# EAGLE design untitled (EAGLE 9.6.2)
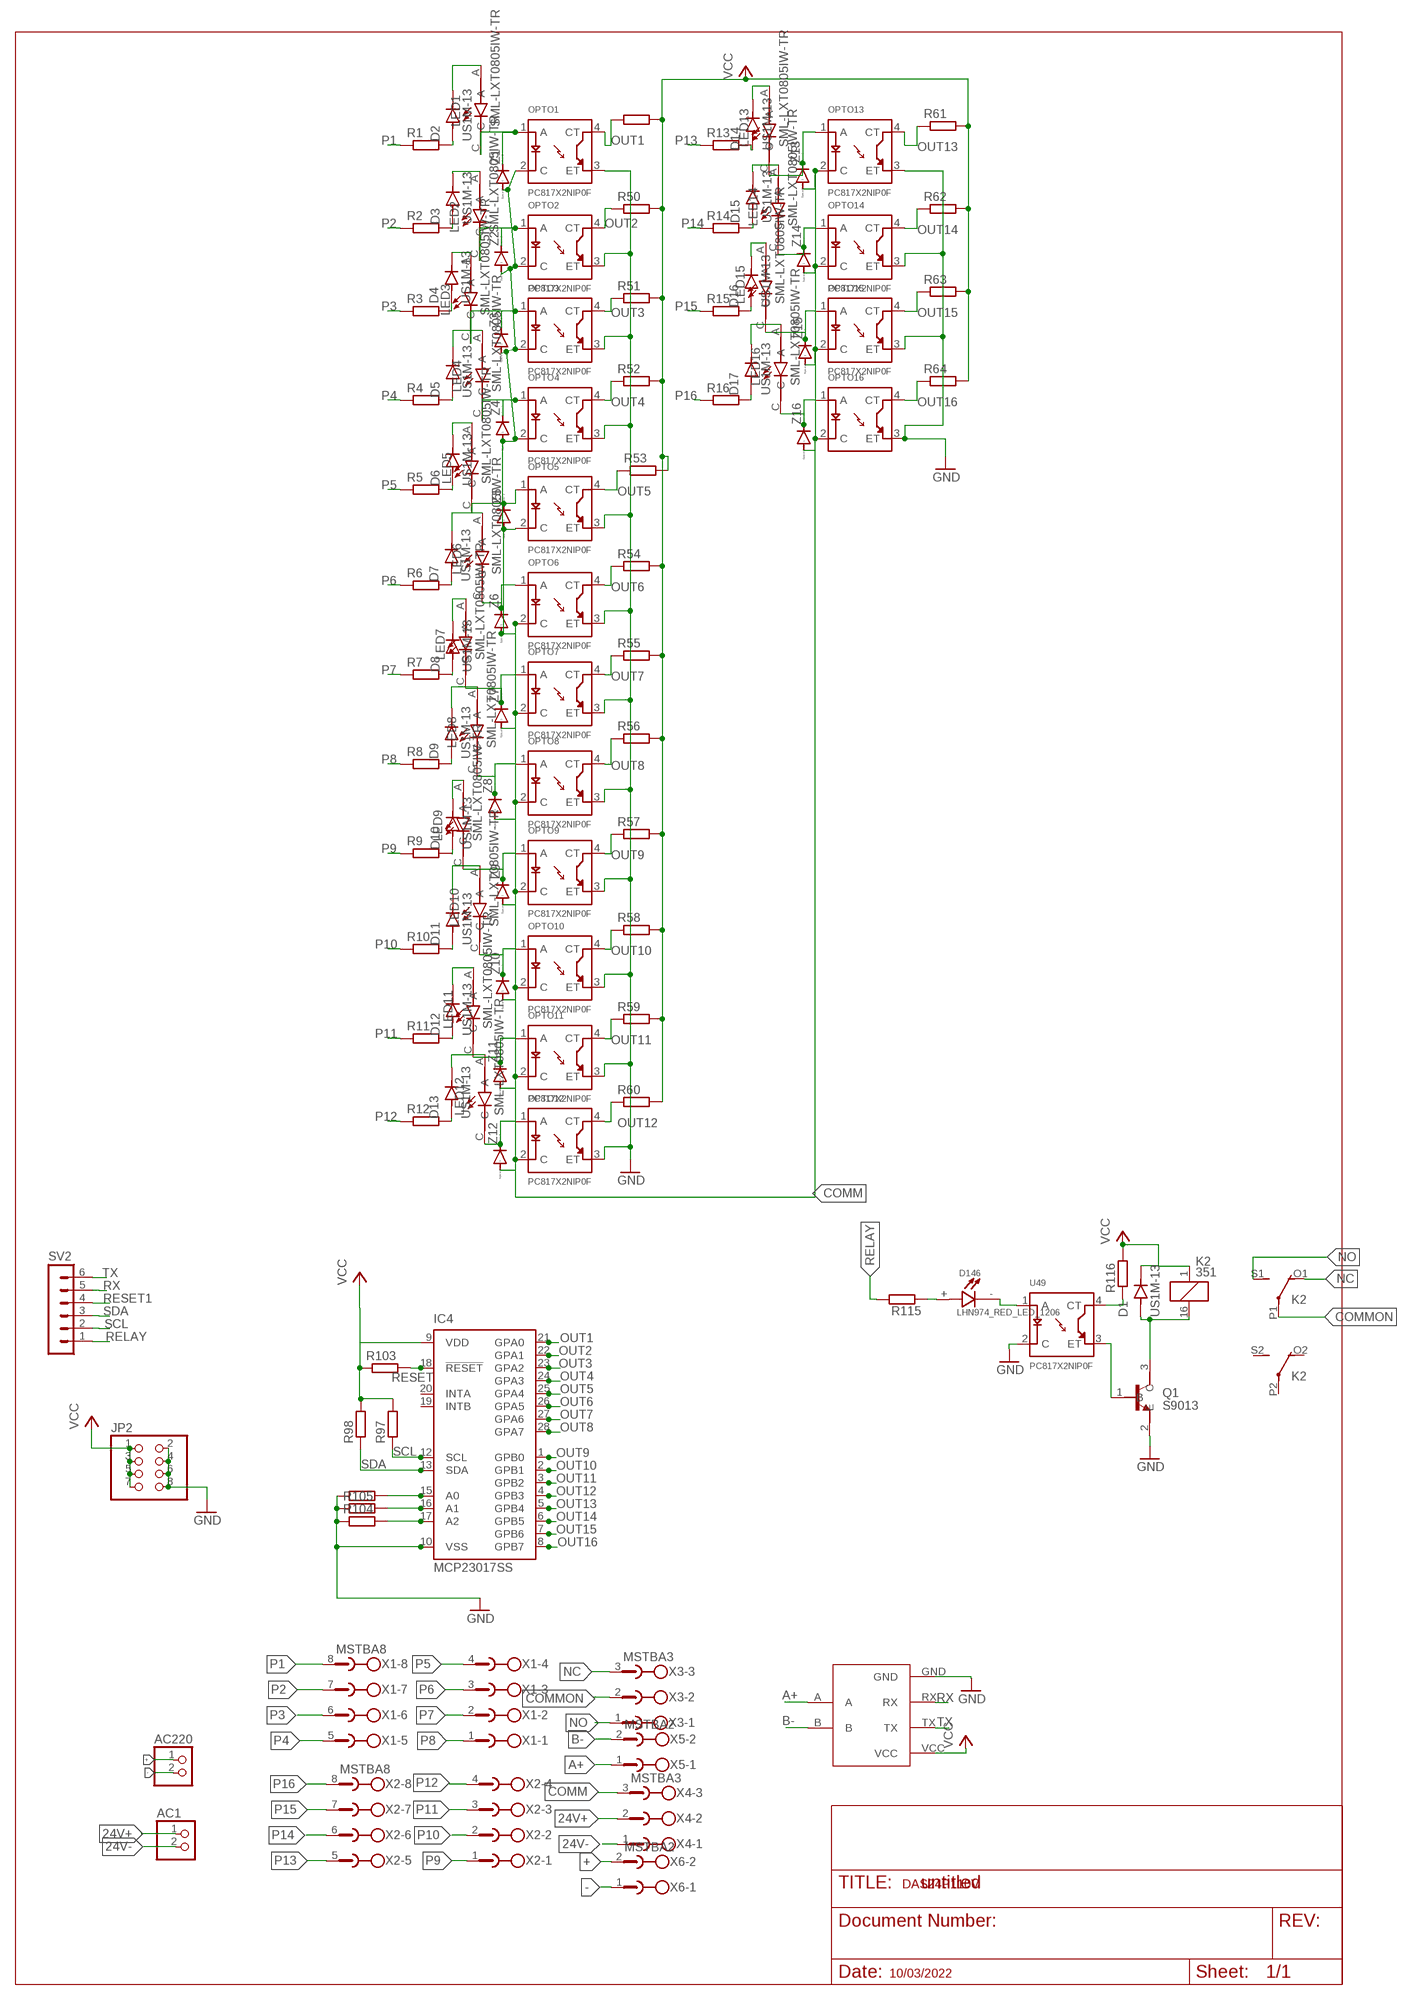
[diagram p0: schematic, sheet 1]

## Parts
AC1  PINHD-1X2  [1X02]
AC220  PINHD-1X2  [1X02]
D1  US1M-13  [DIOM5226X240N]
D2  US1M-13  [DIOM5226X240N]
D3  US1M-13  [DIOM5226X240N]
D4  US1M-13  [DIOM5226X240N]
D5  US1M-13  [DIOM5226X240N]
D6  US1M-13  [DIOM5226X240N]
D7  US1M-13  [DIOM5226X240N]
D8  US1M-13  [DIOM5226X240N]
D9  US1M-13  [DIOM5226X240N]
D10  US1M-13  [DIOM5226X240N]
D11  US1M-13  [DIOM5226X240N]
D12  US1M-13  [DIOM5226X240N]
D13  US1M-13  [DIOM5226X240N]
D14  US1M-13  [DIOM5226X240N]
D15  US1M-13  [DIOM5226X240N]
D16  US1M-13  [DIOM5226X240N]
D17  US1M-13  [DIOM5226X240N]
D146  LHN974_RED_LED_1206  [LEDC3216X120N]
IC4  MCP23017SS  [SSOP28DB]
JP2  PINHD-2X4  [2X04]
K2  351  [351]
LED1  SML-LXT0805IW-TR  [LEDC2012X120N]
LED2  SML-LXT0805IW-TR  [LEDC2012X120N]
LED3  SML-LXT0805IW-TR  [LEDC2012X120N]
LED4  SML-LXT0805IW-TR  [LEDC2012X120N]
LED5  SML-LXT0805IW-TR  [LEDC2012X120N]
LED6  SML-LXT0805IW-TR  [LEDC2012X120N]
LED7  SML-LXT0805IW-TR  [LEDC2012X120N]
LED8  SML-LXT0805IW-TR  [LEDC2012X120N]
LED9  SML-LXT0805IW-TR  [LEDC2012X120N]
LED10  SML-LXT0805IW-TR  [LEDC2012X120N]
LED11  SML-LXT0805IW-TR  [LEDC2012X120N]
LED12  SML-LXT0805IW-TR  [LEDC2012X120N]
LED13  SML-LXT0805IW-TR  [LEDC2012X120N]
LED14  SML-LXT0805IW-TR  [LEDC2012X120N]
LED15  SML-LXT0805IW-TR  [LEDC2012X120N]
LED16  SML-LXT0805IW-TR  [LEDC2012X120N]
OPTO1  PC817X2NIP0F  [SOT254P975X400-4N]
OPTO2  PC817X2NIP0F  [SOT254P975X400-4N]
OPTO3  PC817X2NIP0F  [SOT254P975X400-4N]
OPTO4  PC817X2NIP0F  [SOT254P975X400-4N]
OPTO5  PC817X2NIP0F  [SOT254P975X400-4N]
OPTO6  PC817X2NIP0F  [SOT254P975X400-4N]
OPTO7  PC817X2NIP0F  [SOT254P975X400-4N]
OPTO8  PC817X2NIP0F  [SOT254P975X400-4N]
OPTO9  PC817X2NIP0F  [SOT254P975X400-4N]
OPTO10  PC817X2NIP0F  [SOT254P975X400-4N]
OPTO11  PC817X2NIP0F  [SOT254P975X400-4N]
OPTO12  PC817X2NIP0F  [SOT254P975X400-4N]
OPTO13  PC817X2NIP0F  [SOT254P975X400-4N]
OPTO14  PC817X2NIP0F  [SOT254P975X400-4N]
OPTO15  PC817X2NIP0F  [SOT254P975X400-4N]
OPTO16  PC817X2NIP0F  [SOT254P975X400-4N]
Q1  S9013  [SOT95P240X120-3N]
R1  R-EU_0414/15  [0414/15]
R2  R-EU_0414/15  [0414/15]
R3  R-EU_0414/15  [0414/15]
R4  R-EU_0414/15  [0414/15]
R5  R-EU_0414/15  [0414/15]
R6  R-EU_0414/15  [0414/15]
R7  R-EU_0414/15  [0414/15]
R8  R-EU_0414/15  [0414/15]
R9  R-EU_0414/15  [0414/15]
R10  R-EU_0414/15  [0414/15]
R11  R-EU_0414/15  [0414/15]
R12  R-EU_0414/15  [0414/15]
R13  R-EU_0414/15  [0414/15]
R14  R-EU_0414/15  [0414/15]
R15  R-EU_0414/15  [0414/15]
R16  R-EU_0414/15  [0414/15]
R49  R-EU_R0805  [R0805]
R50  R-EU_R0805  [R0805]
R51  R-EU_R0805  [R0805]
R52  R-EU_R0805  [R0805]
R53  R-EU_R0805  [R0805]
R54  R-EU_R0805  [R0805]
R55  R-EU_R0805  [R0805]
R56  R-EU_R0805  [R0805]
R57  R-EU_R0805  [R0805]
R58  R-EU_R0805  [R0805]
R59  R-EU_R0805  [R0805]
R60  R-EU_R0805  [R0805]
R61  R-EU_R0805  [R0805]
R62  R-EU_R0805  [R0805]
R63  R-EU_R0805  [R0805]
R64  R-EU_R0805  [R0805]
R97  R-EU_R0805  [R0805]
R98  R-EU_R0805  [R0805]
R103  R-EU_R0805  [R0805]
R104  R-EU_R0805  [R0805]
R105  R-EU_R0805  [R0805]
R106  R-EU_R0805  [R0805]
R115  R-EU_R0805  [R0805]
R116  R-EU_R0805  [R0805]
SV2  MA06-1  [MA06-1]
TTL-RS1  TTL-RS485  [TTL-RS485]
U49  PC817X2NIP0F  [SOT254P975X400-4N]
X1  MSTBA8  [MSTBA8]
X2  MSTBA8  [MSTBA8]
X3  MSTBA3  [MSTBA3]
X4  MSTBA3  [MSTBA3]
X5  MSTBA2  [MSTBA2]
X6  MSTBA2  [MSTBA2]
Z1  DIODE-SOD123  [SOD123]
Z2  DIODE-SOD123  [SOD123]
Z3  DIODE-SOD123  [SOD123]
Z4  DIODE-SOD123  [SOD123]
Z5  DIODE-SOD123  [SOD123]
Z6  DIODE-SOD123  [SOD123]
Z7  DIODE-SOD123  [SOD123]
Z8  DIODE-SOD123  [SOD123]
Z9  DIODE-SOD123  [SOD123]
Z10  DIODE-SOD123  [SOD123]
Z11  DIODE-SOD123  [SOD123]
Z12  DIODE-SOD123  [SOD123]
Z13  DIODE-SOD123  [SOD123]
Z14  DIODE-SOD123  [SOD123]
Z15  DIODE-SOD123  [SOD123]
Z16  DIODE-SOD123  [SOD123]

## Nets
24V+: AC1.1 X4.2
24V-: AC1.2 X4.1
+: AC220.1 X6.2
-: AC220.2 X6.1
A+: TTL-RS1.A X5.1
B-: TTL-RS1.B X5.2
COMM: OPTO1.2(C) OPTO2.2(C) OPTO3.2(C) OPTO4.2(C) OPTO5.2(C) OPTO6.2(C) OPTO7.2(C) OPTO8.2(C) OPTO9.2(C) OPTO10.2(C) OPTO11.2(C) OPTO12.2(C) OPTO13.2(C) OPTO14.2(C) OPTO15.2(C) OPTO16.2(C) X4.3 Z1.A Z2.A Z3.A Z4.A Z5.A Z6.A Z7.A Z8.A Z9.A Z10.A Z11.A Z12.A Z13.A Z14.A Z15.A Z16.A
COMMON: K2.P1(2:P) X3.2
GND: IC4.10(VSS) JP2.2 JP2.4 JP2.6 JP2.8 OPTO1.3(ET) OPTO2.3(ET) OPTO3.3(ET) OPTO4.3(ET) OPTO5.3(ET) OPTO6.3(ET) OPTO7.3(ET) OPTO8.3(ET) OPTO9.3(ET) OPTO10.3(ET) OPTO11.3(ET) OPTO12.3(ET) OPTO13.3(ET) OPTO14.3(ET) OPTO15.3(ET) OPTO16.3(ET) Q1.2(E) R104.1 R105.1 R106.1 TTL-RS1.GND U49.2(C)
N$1: D2.A R1.2
N$2: LED10.C OPTO10.1(A) Z10.C
N$3: D3.A R2.2
N$5: D4.A R3.2
N$6: LED1.C OPTO1.1(A) Z1.C
N$7: D5.A R4.2
N$8: D2.C(K) LED1.A
N$9: D6.A R5.2
N$10: D3.C(K) LED2.A
N$11: D7.A R6.2
N$12: LED2.C OPTO2.1(A) Z2.C
N$13: D8.A R7.2
N$14: D4.C(K) LED3.A
N$15: D9.A R8.2
N$16: LED3.C OPTO3.1(A) Z3.C
N$17: D15.A R14.2
N$18: D5.C(K) LED4.A
N$19: LED4.C OPTO4.1(A) Z4.C
N$20: D10.A R9.2
N$21: D6.C(K) LED5.A
N$22: LED5.C OPTO5.1(A) Z5.C
N$23: D7.C(K) LED6.A
N$24: D11.A R10.2
N$25: D8.C(K) LED7.A
N$26: LED6.C OPTO6.1(A) Z6.C
N$28: D12.A R11.2
N$36: D13.A R12.2
N$40: D14.A R13.2
N$44: D16.A R15.2
N$48: D17.A R16.2
N$49: D9.C(K) LED8.A
N$50: D10.C(K) LED9.A
N$51: D11.C(K) LED10.A
N$53: D12.C(K) LED11.A
N$54: D13.C(K) LED12.A
N$55: D14.C(K) LED13.A
N$57: D15.C(K) LED14.A
N$58: D16.C(K) LED15.A
N$59: D17.C(K) LED16.A
N$70: LED7.C OPTO7.1(A) Z7.C
N$72: LED8.C OPTO8.1(A) Z8.C
N$73: LED9.C OPTO9.1(A) Z9.C
N$74: LED11.C OPTO11.1(A) Z11.C
N$75: LED12.C OPTO12.1(A) Z12.C
N$77: LED13.C OPTO13.1(A) Z13.C
N$78: LED14.C OPTO14.1(A) Z14.C
N$79: LED15.C OPTO15.1(A) Z15.C
N$81: LED16.C OPTO16.1(A) Z16.C
N$97: D146.- U49.1(A)
N$98: D146.+ R115.1
N$99: R116.1 U49.4(CT)
N$101: D1.A K2.16 Q1.3(C)
N$102: Q1.1(B) U49.3(ET)
N$109: IC4.15(A0) R106.2
N$110: IC4.16(A1) R105.2
N$111: IC4.17(A2) R104.2
NC: K2.O1(2:O) X3.3
NO: K2.S1(2:S) X3.1
OUT1: IC4.21(GPA0) OPTO1.4(CT) R49.1
OUT2: IC4.22(GPA1) OPTO2.4(CT) R50.1
OUT3: IC4.23(GPA2) OPTO3.4(CT) R51.1
OUT4: IC4.24(GPA3) OPTO4.4(CT) R52.1
OUT5: IC4.25(GPA4) OPTO5.4(CT) R53.1
OUT6: IC4.26(GPA5) OPTO6.4(CT) R54.1
OUT7: IC4.27(GPA6) OPTO7.4(CT) R55.1
OUT8: IC4.28(GPA7) OPTO8.4(CT) R56.1
OUT9: IC4.1(GPB0) OPTO9.4(CT) R57.1
OUT10: IC4.2(GPB1) OPTO10.4(CT) R58.1
OUT11: IC4.3(GPB2) OPTO11.4(CT) R59.1
OUT12: IC4.4(GPB3) OPTO12.4(CT) R60.1
OUT13: IC4.5(GPB4) OPTO13.4(CT) R61.1
OUT14: IC4.6(GPB5) OPTO14.4(CT) R62.1
OUT15: IC4.7(GPB6) OPTO15.4(CT) R63.1
OUT16: IC4.8(GPB7) OPTO16.4(CT) R64.1
P1: R1.1 X1.8
P2: R2.1 X1.7
P3: R3.1 X1.6
P4: R4.1 X1.5
P5: R5.1 X1.4
P6: R6.1 X1.3
P7: R7.1 X1.2
P8: R8.1 X1.1
P9: R9.1 X2.1
P10: R10.1 X2.2
P11: R11.1 X2.3
P12: R12.1 X2.4
P13: R13.1 X2.5
P14: R14.1 X2.6
P15: R15.1 X2.7
P16: R16.1 X2.8
RELAY: R115.2 SV2.1
RESET: IC4.18(!RESET) R103.2
RESET1: SV2.4
RX: SV2.5 TTL-RS1.RX
SCL: IC4.12(SCL) R97.1 SV2.2
SDA: IC4.13(SDA) R98.1 SV2.3
TX: SV2.6 TTL-RS1.TX
VCC: D1.C(K) IC4.9(VDD) JP2.1 JP2.3 JP2.5 JP2.7 K2.1 R49.2 R50.2 R51.2 R52.2 R53.2 R54.2 R55.2 R56.2 R57.2 R58.2 R59.2 R60.2 R61.2 R62.2 R63.2 R64.2 R97.2 R98.2 R103.1 R116.2 TTL-RS1.VCC
Unconnected: IC4.19(INTB) IC4.20(INTA) K2.O2(3:O) K2.P2(3:P) K2.S2(3:S)

## Notes on the sheet
- DAS24P110V
- 10/03/2022

## Library data of the parts
AC1 AC220 = pinhead:PINHD-1X2: PIN HEADER
D1-D17 = US1M-13:US1M-13: Diode, Fast Recovery, 1a, 1kv, Do-214ac-2, Full Reel Check availability <https://pricing.snapeda.com/parts/US1M-13/Diodes%20Incorporated/view-part?ref=eda>; AVAILABILITY: In Stock; DESCRIPTION: Diode Standard 1000 V 1A Surface Mount SMA; MF: Diodes Incorporated; MP: US1M-13; PACKAGE: DO-214AC-214 Diodes Incorporated; PRICE: None; PURCHASE-URL: https://pricing.snapeda.com/search/part/US1M-13/?ref=eda
D146 = LHN974_RED_LED_1206:LHN974_RED_LED_1206: LED Chip 1206 Check availability <https://pricing.snapeda.com/parts/LHN974%20RED%20LED%201206/Osram/view-part?ref=eda>; AVAILABILITY: Not in stock; DESCRIPTION: 2.6 V Red LED SMD; MF: Osram; MP: LHN974 RED LED 1206; PACKAGE: None; PRICE: None
IC4 = adafruit_edited:MCP23017: http://ww1.microchip.com/downloads/en/DeviceDoc/21952a.pdf Source: http://ww1.microchip.com/downloads/en/DeviceDoc/21952a.pdf
JP2 = pinhead:PINHD-2X4: PIN HEADER
K2 = relay:351: RELAY 2 x switch, Omron; OC_FARNELL: unknown; OC_NEWARK: unknown
LED1-LED16 = SML-LXT0805IW-TR:SML-LXT0805IW-TR: LED; Luminous Intensity:11µcd; Viewing Angle:140°; Forward Current:30mA; Forward Voltage:2V; Color:Red; LED Color:Red; Leaded Process Compatible:Yes; Lens Color:White; Mounting Type:Surface Mount ;RoHS Compliant: Yes Check availability <https://pricing.snapeda.com/parts/SML-LXT0805IW-TR/Lumex%20Opto/Components/view-part?ref=eda>; AVAILABILITY: In Stock; DESCRIPTION: Red - LED Indication - Discrete 2V 0805 (2012 Metric); MF: Lumex Opto/Components; MP: SML-LXT0805IW-TR; PACKAGE: 0805 Lumex; PRICE: None; PURCHASE-URL: https://pricing.snapeda.com/search/part/SML-LXT0805IW-TR/?ref=eda
OPTO1-OPTO16 U49 = PC817X2NIP0F:PC817X2NIP0F: PC817 Series 1 Channel 80 V 5000 Vrms General Purpose Photocoupler - DIP-4 Check availability <https://pricing.snapeda.com/parts/PC817X2NIP0F/Sharp%20Microelectronics/view-part?ref=eda>; AVAILABILITY: Not in stock; DESCRIPTION: Optoisolator Transistor Output 5000Vrms 1 Channel 4-SMD; MF: Sharp Microelectronics; MP: PC817X2NIP0F; PACKAGE: SMD-4 Sharp Microelectronics; PRICE: None
Q1 = S9013:S9013: SMD Transistors NPN 25V-500mA Check availability <https://pricing.snapeda.com/parts/S9013/JCET/view-part?ref=eda>; AVAILABILITY: Not in stock; DESCRIPTION: Bipolar (BJT) Transistor NPN 20V 500mA 625mW Through Hole TO-92-3; MF: JCET; MP: S9013; PACKAGE: SOT-23-3 JCET; PRICE: None
R1-R16 R49-R64 R97 R98 R103-R106 R115 R116 = rcl:R-EU_: RESISTOR, European symbol; SPICEPREFIX: R
SV2 = con-lstb:MA06-1: PIN HEADER; OC_FARNELL: unknown; OC_NEWARK: unknown
TTL-RS1 = TTL-RS485:TTL-RS485
X1 X2 = con-phoenix-508:MSTBA8: PHOENIX; MF: FARNELL; MPN: 1757307; OC_FARNELL: 3705225; OC_NEWARK: 71C4166
X3 X4 = con-phoenix-508:MSTBA3: PHOENIX; MF: FARNELL; MPN: 1757255; OC_FARNELL: 3705183; OC_NEWARK: 71C4162
X5 X6 = con-phoenix-508:MSTBA2: PHOENIX; MF: FARNELL; MPN: 1757242; OC_FARNELL: 3705171; OC_NEWARK: 71C4161
Z1-Z16 = diode:DIODE-: DIODE

## Net classes
0 default: drill 0.3 mm, clearance 0.2 mm

## Board
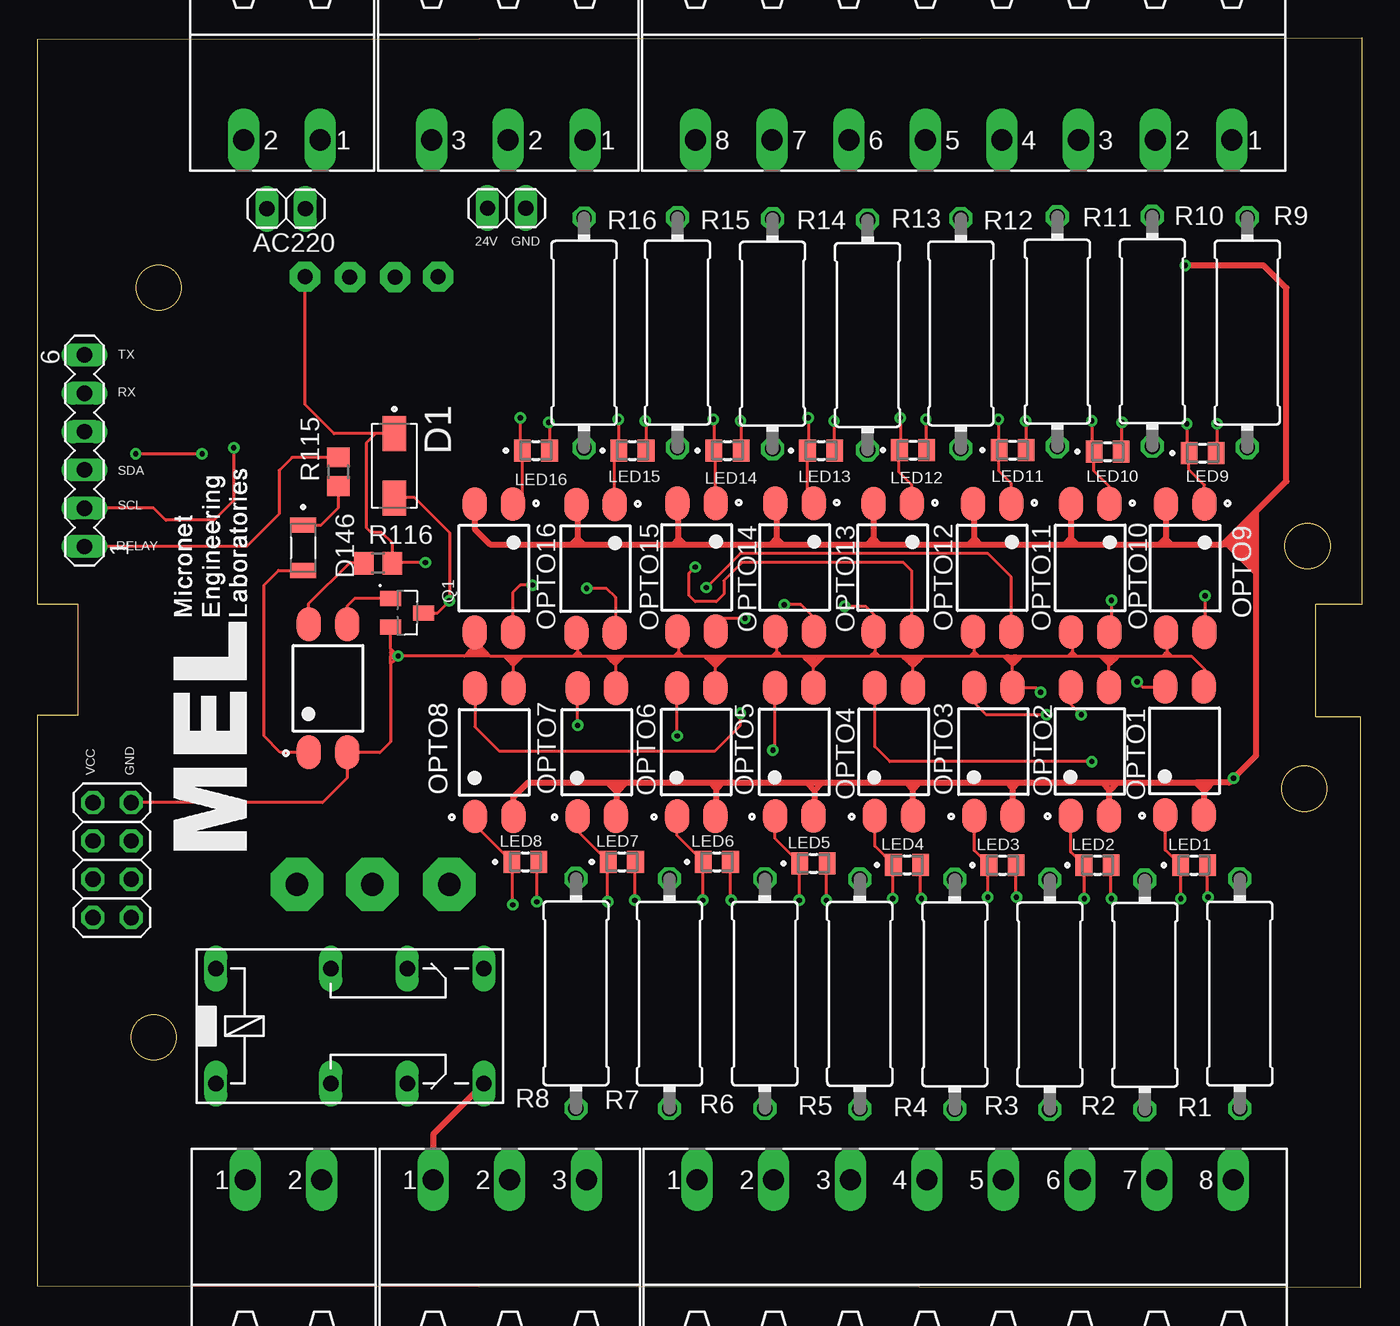
[diagram p1: board, top side]
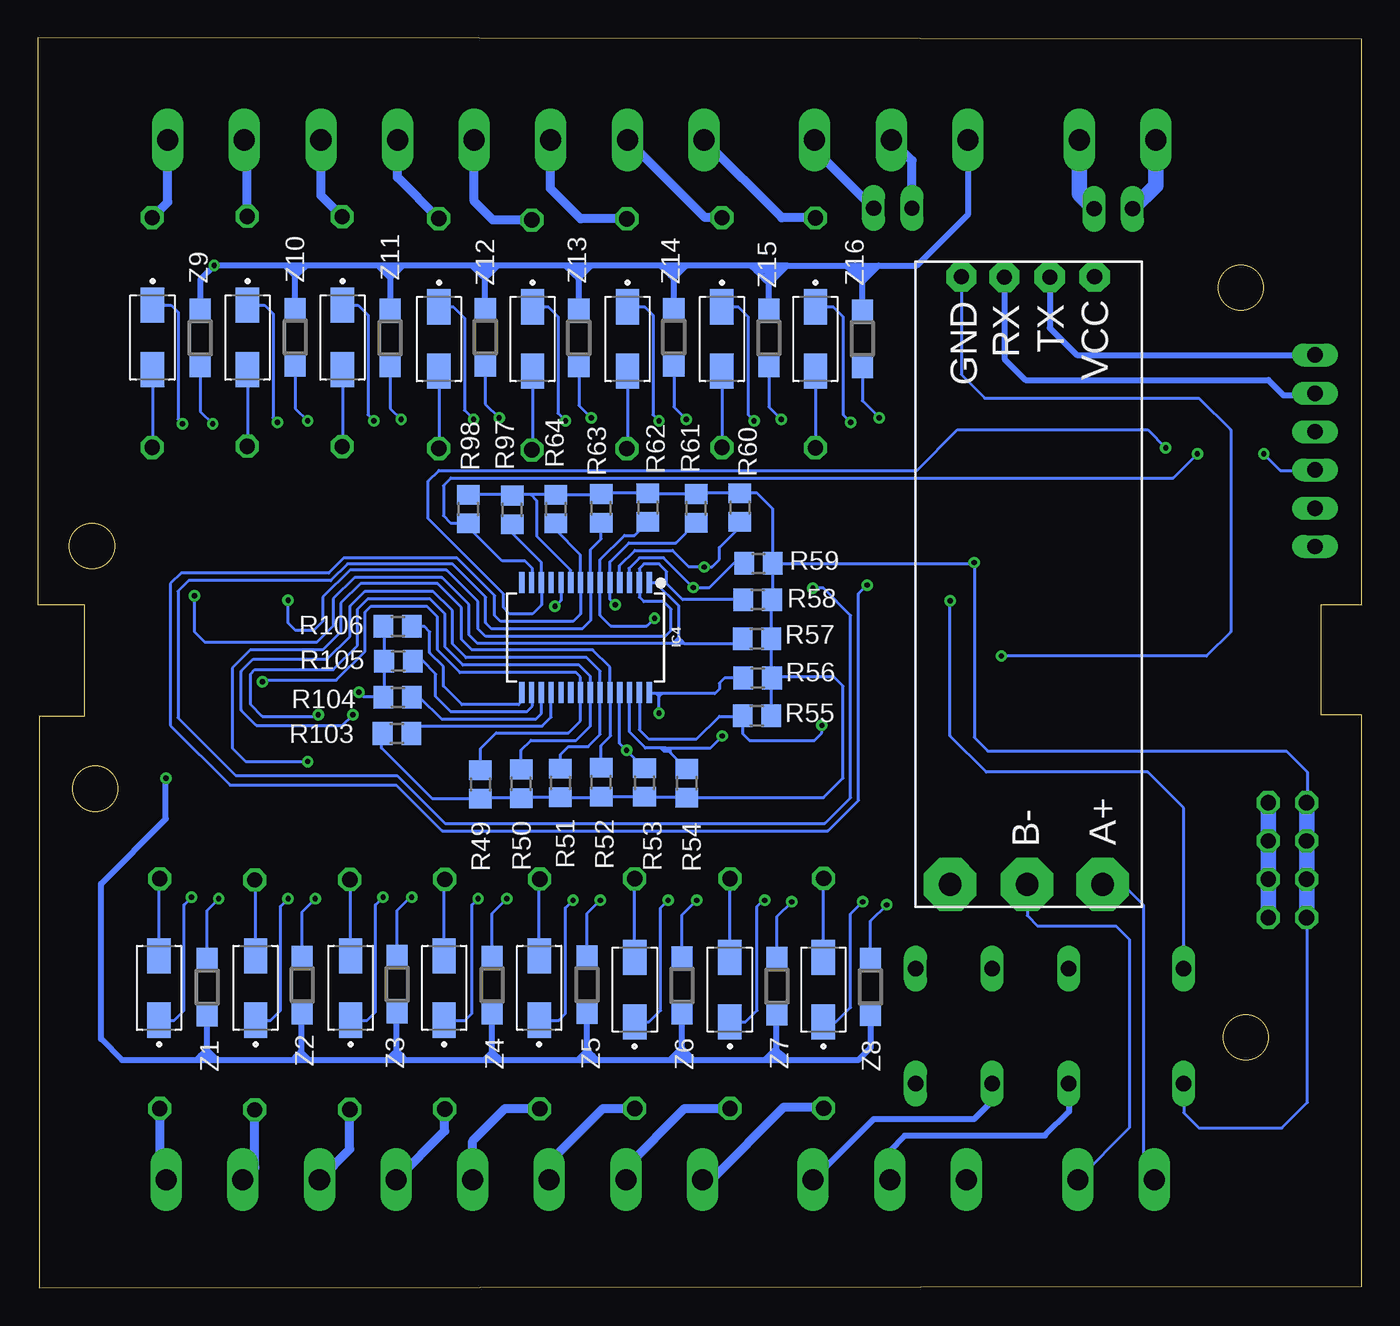
[diagram p2: board, bottom side, seen from below]

Size 87.8 x 82.9 mm. Coordinates in mm from the lower left corner, seen from the top.
Outline: 0,0.1 0,38 2.7,38 2.7,45.3 0,45.3 0,82.8 87.8,82.9 87.8,45.3 84.7,45.3 84.7,37.9 87.7,37.9 87.7,0 0,0.1
Outline: circle at 8.01,66.33 radius 1.5
Outline: circle at 84.2,49.2 radius 1.5
Outline: circle at 84,33.1 radius 1.5
Outline: circle at 7.7,16.6 radius 1.5
Copper layers (1*16): Top 0.035mm / dielectric 1.5mm / Bottom 0.035mm
Design rules "default": minimum track width 6mil, minimum drill 0.35mm, track to track 6mil, track to pad 6mil, pad to pad 6mil, via to via 6mil, smd to smd 6mil, copper to edge 40mil, drill to drill 6mil, minimum pad ring 10mil, minimum via ring 8mil, stop-mask expansion 4mil, vias tented up to drill 0mil, thermal gap 10mil

### Footprints (pad centres in the part's own frame; a part is rotated, then mirrored left to right if it is on the bottom)
1X02 = drill 1.016 long: 1 -1.27,0; 2 1.27,0
DIOM5226X240N = smd 2.33 x 1.55: A 2.135,0; C -2.135,0
LEDC3216X120N = smd 1.01 x 1.73: + -1.51,0; - 1.51,0
SSOP28DB = smd 0.348 x 1.397: 1 -4.225,-3.656; 2 -3.575,-3.656; 3 -2.925,-3.656; 4 -2.275,-3.656; 5 -1.625,-3.656; 6 -0.975,-3.656; 7 -0.325,-3.656; 8 0.325,-3.656; 9 0.975,-3.656; 10 1.625,-3.656; 11 2.275,-3.656; 12 2.925,-3.656; 13 3.575,-3.656; 14 4.225,-3.656; 15 4.225,3.656; 16 3.575,3.656; 17 2.925,3.656; 18 2.275,3.656; 19 1.625,3.656; 20 0.975,3.656; 21 0.325,3.656; 22 -0.325,3.656; 23 -0.975,3.656; 24 -1.625,3.656; 25 -2.275,3.656; 26 -2.925,3.656; 27 -3.575,3.656; 28 -4.225,3.656
2X04 = drill 1.016 octagon: 1 -3.81,-1.27; 2 -3.81,1.27; 3 -1.27,-1.27; 4 -1.27,1.27; 5 1.27,-1.27; 6 1.27,1.27; 7 3.81,-1.27; 8 3.81,1.27
351 = drill 1.016 long: 1 -3.81,-3.81; 16 -3.81,3.81; O1 8.89,-3.81; O2 8.89,3.81; P1 3.81,-3.81; P2 3.81,3.81; S1 13.97,-3.81; S2 13.97,3.81
LEDC2012X120N = smd 1.1 x 1.45: A 0.9,0; C -0.9,0
SOT254P975X400-4N = smd 2.25 x 1.6: 1 -4.25,1.27; 2 -4.25,-1.27; 3 4.25,-1.27; 4 4.25,1.27
SOT95P240X120-3N = smd 1 x 1.4: 1 -0.95,-1.1; 2 0.95,-1.1; 3 0,1.1
0414/15 = drill 1.016 octagon: 1 -7.62,0; 2 7.62,0
R0805 = smd 1.3 x 1.5: 1 -0.95,0; 2 0.95,0
MA06-1 = drill 1.016 long: 1 -6.35,0; 2 -3.81,0; 3 -1.27,0; 4 1.27,0; 5 3.81,0; 6 6.35,0
TTL-RS485 = drill 1.5 pad 3.5 octagon: A -19.7,-6; B -19.7,-1; P$7 -19.7,4.1 | drill 1 pad 2 octagon: GND 20.6,3.37; RX 20.581,0.505; TX 20.583,-2.493; VCC 20.6,-5.47
MSTBA8 = drill 1.397 long: 1 -17.78,5.08; 2 -12.7,5.08; 3 -7.62,5.08; 4 -2.54,5.08; 5 2.54,5.08; 6 7.62,5.08; 7 12.7,5.08; 8 17.78,5.08
MSTBA3 = drill 1.397 long: 1 -5.08,5.08; 2 0,5.08; 3 5.08,5.08
MSTBA2 = drill 1.397 long: 1 -2.54,5.08; 2 2.54,5.08
SOD123 = smd 1.4 x 1.4: A 1.9,0; C -1.9,0

### Placement (x,y rotation side)
AC1  31.1,71.6 0 top
AC220  16.47,71.56 0 top
D1  23.65,54.51 270 top
D2  79.75,19.89 90 bottom
D3  73.35,19.89 90 bottom
D4  67.05,19.89 90 bottom
D5  60.85,19.89 90 bottom
D6  54.55,19.89 90 bottom
D7  48.21,19.78 90 bottom
D8  41.91,19.78 90 bottom
D9  35.71,19.78 90 bottom
D10  80.19,63.02 270 bottom
D11  73.89,63.02 270 bottom
D12  67.59,63.02 270 bottom
D13  61.19,62.92 270 bottom
D14  54.99,62.92 270 bottom
D15  48.69,62.92 270 bottom
D16  42.43,62.92 270 bottom
D17  36.23,62.92 270 bottom
D146  17.6,49.08 270 top
IC4  51.48,43.13 180 bottom
JP2  4.93,28.37 270 top
K2  15.62,17.36 0 top
LED1  76.67,28.03 0 top
LED2  70.27,28.03 0 top
LED3  63.97,28.03 0 top
LED4  57.64,28.05 0 top
LED5  51.44,28.15 0 top
LED6  45.04,28.25 0 top
LED7  38.74,28.25 0 top
LED8  32.34,28.25 0 top
LED9  77.24,55.35 0 top
LED10  70.94,55.45 0 top
LED11  64.64,55.55 0 top
LED12  58.04,55.55 0 top
LED13  51.94,55.53 0 top
LED14  45.74,55.53 0 top
LED15  39.44,55.53 0 top
LED16  33.04,55.53 0 top
OPTO1  76.04,35.61 90 top
OPTO2  69.77,35.57 90 top
OPTO3  63.37,35.56 90 top
OPTO4  56.77,35.55 90 top
OPTO5  50.17,35.54 90 top
OPTO6  43.67,35.53 90 top
OPTO7  37.07,35.52 90 top
OPTO8  30.27,35.51 90 top
OPTO9  76.09,47.73 270 top
OPTO10  69.79,47.74 270 top
OPTO11  63.29,47.75 270 top
OPTO12  56.69,47.76 270 top
OPTO13  50.19,47.77 270 top
OPTO14  43.69,47.78 270 top
OPTO15  36.99,47.69 270 top
OPTO16  30.25,47.73 270 top
Q1  24.5,44.76 270 top
R1  79.71,19.51 90 top
R2  73.41,19.43 90 top
R3  67.11,19.45 90 top
R4  60.81,19.47 90 top
R5  54.51,19.49 90 top
R6  48.21,19.51 90 top
R7  41.89,19.51 90 top
R8  35.69,19.53 90 top
R9  80.21,63.35 270 top
R10  73.91,63.43 270 top
R11  67.61,63.41 270 top
R12  61.21,63.29 270 top
R13  55.03,63.19 270 top
R14  48.73,63.27 270 top
R15  42.43,63.35 270 top
R16  36.23,63.33 270 top
R49  58.44,33.38 270 bottom
R50  55.74,33.43 270 bottom
R51  53.14,33.48 270 bottom
R52  50.44,33.53 270 bottom
R53  47.56,33.51 270 bottom
R54  44.76,33.46 270 bottom
R55  40.11,37.94 0 bottom
R56  40.06,40.44 0 bottom
R57  40.11,43.04 0 bottom
R58  40.06,45.64 0 bottom
R59  40.01,48.04 0 bottom
R60  41.24,51.74 90 bottom
R61  44.14,51.69 90 bottom
R62  47.34,51.74 90 bottom
R63  50.44,51.69 90 bottom
R64  53.44,51.64 90 bottom
R97  56.34,51.59 90 bottom
R98  59.24,51.64 90 bottom
R103  63.98,36.76 0 bottom
R104  63.93,39.16 0 bottom
R105  63.88,41.56 0 bottom
R106  63.93,43.86 0 bottom
R115  19.94,54.12 90 top
R116  22.57,48.06 0 top
SV2  3.1,55.51 90 top
TTL-RS1  23.19,46.45 90 bottom
U49  19.25,39.76 90 top
X1  61.5,2.1 0 top
X2  61.4,81.2 180 top
X3  31.3,2.1 0 top
X4  31.2,81.2 180 top
X5  16.3,2.1 0 top
X6  16.2,81.2 180 top
Z1  76.56,19.94 270 bottom
Z2  70.26,20.09 270 bottom
Z3  63.96,20.14 270 bottom
Z4  57.66,20.09 270 bottom
Z5  51.38,20.11 270 bottom
Z6  45.08,20.06 270 bottom
Z7  38.78,20.01 270 bottom
Z8  32.58,19.96 270 bottom
Z9  77.02,62.99 90 bottom
Z10  70.72,63.04 90 bottom
Z11  64.42,62.99 90 bottom
Z12  58.12,63.04 90 bottom
Z13  51.92,62.99 90 bottom
Z14  45.62,63.04 90 bottom
Z15  39.32,62.99 90 bottom
Z16  33.12,62.94 90 bottom

### Tracks (layer width: path | path; a pad name or v marks a point on that pad's centre or on a via)
24V+
  Bottom 0.61: AC1.1 29.83,74.75 X4.2
24V-
  Bottom 0.61: AC1.2 36.28,75.51 X4.1
+
  Bottom 1.016: AC220.1 13.66,73.1 X6.2
-
  Bottom 1.016: AC220.2 18.74,72.56 X6.1
A+
  Bottom 0.2: TTL-RS1.A 15.85,26.75 14.5,25.4 14.5,7.92 X5.1
B-
  Bottom 0.2: TTL-RS1.B 22.19,24.69 21.5,24 16.3,24 15.4,23.1 15.4,10.62 X5.2
COMM  (via drill 0.35)
  Top 0.406: OPTO16.2 28.98,50.32 30,49.3 35.4,49.3 | 35.4,49.3 35.8,49.7 | 35.8,49.7 35.8,51.86 OPTO15.2 | 35.4,49.3 36.2,49.3 | 36.2,49.3 42.15,49.3 | 42.15,49.3 42.5,49.3 | 42.5,49.3 42.5,49.66 | 42.5,49.66 42.5,51.95 OPTO14.2 | 42.5,49.3 42.89,49.3 | 42.89,49.3 48.62,49.3 | 48.62,49.3 48.9,49.3 | 48.9,49.3 49,49.4 49,49.68 | 49,49.68 49,51.94 OPTO13.2 | 48.9,49.3 49.38,49.3 | 49.38,49.3 55.01,49.3 | 55.01,49.3 55.3,49.3 | 55.42,49.71 55.42,49.42 55.3,49.3 | OPTO12.2 55.42,49.71 | 55.3,49.3 55.83,49.3 | 55.83,49.3 61.74,49.3 | 61.74,49.3 62,49.3 | 62,49.3 62.1,49.4 62.1,49.66 | 62.1,49.66 62.1,51.92 OPTO11.2 | 62,49.3 62.52,49.3 | 62.52,49.3 68.11,49.3 | 68.11,49.3 68.3,49.3 | 68.52,49.68 68.52,49.52 68.3,49.3 | OPTO10.2 68.52,49.71 | 68.3,49.3 68.9,49.3 | 68.9,49.3 74.39,49.3 | 74.39,49.3 74.6,49.3 | 74.82,49.66 74.82,49.52 74.6,49.3 | OPTO9.2 74.82,49.73 | OPTO8.2 31.54,32.54 32.5,33.5 37.8,33.5 | 37.8,33.5 38.1,33.5 | 38.1,33.5 38.4,33.2 38.4,32.9 | 38.4,32.9 38.4,31.33 OPTO7.2 | 38.1,33.5 39,33.5 | 39,33.5 44.6,33.5 | 44.6,33.5 45,33.1 | 45,33.1 45,31.34 OPTO6.2 | 44.6,33.5 45.4,33.5 | 45.4,33.5 51,33.5 | 51,33.5 51.5,33 | 51.5,33 51.5,31.35 OPTO5.2 | 51,33.5 52,33.5 | 52,33.5 57.6,33.5 | OPTO4.2 58.04,33.06 | 57.6,33.5 58.04,33.06 | 57.6,33.5 58.48,33.5 | 58.48,33.5 64.3,33.5 | 64.64,33.16 OPTO3.2 | 64.3,33.5 64.64,33.16 | 64.3,33.5 65,33.5 | 65,33.5 70.6,33.5 | 71.04,33.06 OPTO2.2 | 70.6,33.5 71.04,33.06 | 70.6,33.5 71.6,33.5 | 71.6,33.5 76.8,33.5 | 77.31,32.99 OPTO1.2 | 76.8,33.5 77.31,32.99 | 74.6,49.3 75.17,49.3 | 75.17,49.3 78.6,49.3 | 78.6,49.3 80.8,51.5 | 80.8,51.5 82.8,53.5 82.8,66.3 81.3,67.8 v76.1,67.8 | 77.9,33.5 79,33.5 v79.3,33.8 80.8,35.3 80.8,47.4 | 77.9,33.5 77.2,33.5
  Top 0.406: 77.2,33.5 76.8,33.5 | 80.8,47.4 80.35,47.85 | 80.35,47.85 80,48.2 | 80,48.2 79.8,48.4 | 79.65,48.55 79.8,48.4 | 79.65,48.55 79.35,48.85 | 79.15,49.05 79.35,48.85 | 79.15,49.05 78.9,49.3 | 78.9,49.3 78.6,49.3 | 38.4,32.9 39,33.5 | 38.4,32.9 37.8,33.5 | 45,33.1 45.4,33.5 | 51.5,33 52,33.5 | 58.04,33.06 58.48,33.5 | 64.64,33.16 64.66,33.16 65,33.5 | 71.04,33.06 71.16,33.06 71.6,33.5 | 77.31,32.99 77.39,32.99 77.55,33.15 | 77.55,33.15 77.9,33.5 | 77.2,33.5 77.55,33.15 | 80.8,47.4 80.8,48 | 80.8,48 80.8,48.6 | 80.8,48.6 80.8,49 | 80.8,49 80.8,49.5 | 80.8,49.5 80.8,49.9 | 80.8,49.9 80.8,50.5 | 80.8,50.5 80.8,50.8 | 80.8,50.8 80.8,51.5 | 78.9,49.3 80.3,50.7 | 80.3,50.7 80.4,50.8 | 80.4,50.8 80.8,50.8 | 79.15,49.05 80.3,50.2 | 80.3,50.2 80.3,50.7 | 80.8,50.5 80.65,50.35 | 80.65,50.35 80.5,50.2 80.3,50.2 | 80.4,50.8 80.65,50.55 80.65,50.35 | 80.8,49.9 80.5,49.9 79.45,48.85 79.35,48.85 | 79.65,48.55 80.6,49.5 80.8,49.5 | 79.8,48.4 80.2,48.8 | 80.2,48.8 80.4,49 | 80.8,49 80.4,49 | 80,48.2 80.4,48.2 80.6,48.4 | 80.6,48.4 80.75,48.55 | 80.75,48.55 80.8,48.6 | 79.8,48.4 80.4,48.4 | 80.4,48.4 80.6,48.4 | 80.4,49 80.4,48.9 80.75,48.55 | 80.2,48.8 80.2,48.6 80.4,48.4 | 80.35,47.85 80.5,48 80.8,48 | 35.8,49.7 36.2,49.3 | 42.5,49.66 42.15,49.3 | 42.5,49.66 42.54,49.66 42.89,49.3 | 49,49.68 48.62,49.3 | 49,49.68 49.38,49.3 | 55.42,49.71 55.01,49.3 | 55.42,49.71 55.83,49.3 | 61.74,49.3 62.1,49.66 | 62.1,49.66 62.17,49.66 62.52,49.3 | 68.52,49.71 68.11,49.3 | 68.52,49.71 68.52,49.68 | 68.52,49.68 68.9,49.3 | 74.82,49.73 74.39,49.3 | 74.82,49.73 74.82,49.66 | 74.82,49.66 75.17,49.3
  Bottom 0.406: Z8.A 32.58,15.92 33.4,15.1 38.1,15.1 | 38.1,15.1 38.45,15.45 | 38.45,15.45 38.8,15.8 | 38.8,15.8 38.8,18.09 Z7.A | 38.1,15.1 39.6,15.1 | 39.6,15.1 44.3,15.1 | 44.3,15.1 44.65,15.45 | 44.65,15.45 45.1,15.9 | 45.1,15.9 45.1,18.14 Z6.A | 44.3,15.1 45.9,15.1 | 45.9,15.1 50.7,15.1 | 50.7,15.1 51,15.4 | 51,15.4 51.4,15.8 | 51.4,15.8 51.4,18.19 Z5.A | 50.7,15.1 51.5,15.1 | 51.5,15.1 52,15.1 | 52,15.1 57.1,15.1 | 57.1,15.1 57.3,15.3 | 57.3,15.3 57.7,15.7 | 57.7,15.7 57.7,18.15 Z4.A | 57.1,15.1 58.2,15.1 | 58.2,15.1 63.4,15.1 | 63.4,15.1 63.75,15.45 | 63.75,15.45 64,15.7 | 64,15.7 64,18.2 Z3.A | 63.4,15.1 64.6,15.1 | 64.6,15.1 69.8,15.1 | 69.8,15.1 70.15,15.45 | 70.15,15.45 70.3,15.6 | 70.3,15.6 70.3,18.15 Z2.A | 69.8,15.1 70.9,15.1 | 70.9,15.1 75.9,15.1 | 76.56,15.76 Z1.A | 75.9,15.1 76.15,15.35 | 76.15,15.35 76.56,15.76 | Z16.A 33.12,66.72 | 33.12,66.72 33.4,67 | 33.4,67 33.55,67.15 | 33.55,67.15 33.85,67.45 | 33.85,67.45 34.2,67.8 | 38.1,67.8 34.2,67.8 | Z15.A 39.32,66.58 | 38.1,67.8 38.45,67.45 | 38.45,67.45 38.65,67.25 | 38.65,67.25 39,66.9 | 39,66.9 39.32,66.58 | 38.1,67.8 40.5,67.8 | 40.5,67.8 44.8,67.8 | Z14.A 45.62,66.98 | 44.8,67.8 45.1,67.5 | 45.1,67.5 45.35,67.25 | 45.35,67.25 45.62,66.98 | 44.8,67.8 46.5,67.8 | 46.5,67.8 51.1,67.8 | Z13.A 51.92,66.98 | 51.1,67.8 51.4,67.5 | 51.4,67.5 51.7,67.2 | 51.7,67.2 51.92,66.98 | 51.1,67.8 52.8,67.8 | 52.8,67.8 57.3,67.8 | Z12.A 58.12,66.98 | 57.3,67.8 57.6,67.5 | 57.6,67.5 57.9,67.2 | 57.9,67.2 58.12,66.98 | 57.3,67.8 59,67.8 | 59,67.8 63.6,67.8 | 64.42,66.98 Z11.A | 63.6,67.8 64,67.4 | 64,67.4 64.42,66.98 | 63.6,67.8 65.24,67.8 | 65.24,67.8 70,67.8 | Z10.A 70.72,67.08 | 70,67.8 70.35,67.45 | 70.35,67.45 70.72,67.08 | 70,67.8 71.4,67.8 | 71.4,67.8 v76.1,67.8 77.02,66.88 Z9.A
  Bottom 0.406: 34.2,67.8 33.6,67.8 | 33.6,67.8 32.04,67.8 | 32.04,67.8 29.5,67.8 26.1,71.2 26.1,76.1 X4.3 | 75.9,15.1 77.3,15.1 | 77.3,15.1 82.2,15.1 83.6,16.5 83.6,26.8 79.3,31.1 v79.3,33.8 | 33.12,66.72 32.69,67.15 | 32.69,67.15 32.39,67.45 | 32.39,67.45 32.04,67.8 | 33.12,66.72 33.12,67.32 33.4,67.6 | 33.4,67 33.4,67.6 | 33.4,67.6 33.6,67.8 | 33.85,67.45 32.39,67.45 | 33.55,67.15 32.69,67.15 | 39.32,66.58 39.32,66.62 39.6,66.9 | 39.65,66.95 40.15,67.45 | 40.15,67.45 40.5,67.8 | 38.45,67.45 40.15,67.45 | 38.65,67.25 39.35,67.25 39.65,66.95 | 39,66.9 39.6,66.9 | 39.6,66.9 39.65,66.95 | 45.62,66.98 45.68,66.98 45.85,67.15 | 45.85,67.15 46.15,67.45 | 46.15,67.45 46.5,67.8 | 45.1,67.5 46.1,67.5 46.15,67.45 | 45.35,67.25 45.75,67.25 45.85,67.15 | 51.92,66.98 51.98,66.98 52.2,67.2 | 52.2,67.2 52.35,67.35 | 52.35,67.35 52.8,67.8 | 51.7,67.2 52.2,67.2 | 51.4,67.5 52.2,67.5 52.35,67.35 | 58.12,66.98 58.18,66.98 58.3,67.1 | 58.3,67.1 58.65,67.45 | 58.65,67.45 59,67.8 | 57.6,67.5 58.6,67.5 58.65,67.45 | 57.9,67.2 58.2,67.2 58.3,67.1 | 64.42,66.98 64.77,67.33 | 64.77,67.33 65.24,67.8 | 64,67.4 64.7,67.4 64.77,67.33 | 70.72,67.08 70.72,67.12 70.95,67.35 | 70.95,67.35 71.4,67.8 | 70.35,67.45 70.85,67.45 70.95,67.35 | 38.8,15.8 38.9,15.8 39.25,15.45 | 39.25,15.45 39.6,15.1 | 38.45,15.45 39.25,15.45 | 45.1,15.9 45.5,15.5 | 45.5,15.5 45.9,15.1 | 44.65,15.45 45.45,15.45 45.5,15.5 | 51.4,15.8 51.4,15.7 52,15.1 | 51,15.4 51.2,15.4 51.5,15.1 | 57.7,15.7 57.7,15.6 57.9,15.4 | 57.9,15.4 58.2,15.1 | 57.3,15.3 57.8,15.3 57.9,15.4 | 64,15.7 64.25,15.45 | 64.25,15.45 64.6,15.1 | 63.75,15.45 64.25,15.45 | 70.3,15.6 70.4,15.6 70.55,15.45 | 70.55,15.45 70.9,15.1 | 70.15,15.45 70.55,15.45
  Bottom 0.406: 76.56,15.76 76.64,15.76 77,15.4 | 77,15.4 77.3,15.1 | 76.15,15.35 76.95,15.35 77,15.4
COMMON
  Bottom 0.406: X3.2 31.3,9.1 30.3,10.1 21,10.1 19.4,11.7 19.4,13.52 K2.P1
GND  (via drill 0.35)
  Top 0.2: 29.55,42.35 28.98,42.92 OPTO16.3 28.98,42.58 28.75,42.35 | 29.55,42.35 29.65,42.25 | 29.65,42.25 29.8,42.1 | 29.8,42.1 30,41.9 | 30,41.9 30.9,41.9 | 30.9,41.9 32.18,41.9 | 32.18,41.9 35.5,41.9 | 35.5,41.9 35.65,42.05 | 35.65,42.05 35.8,42.2 | 35.8,42.2 35.8,43.36 OPTO15.3 | 35.5,41.9 36.1,41.9 | 36.1,41.9 37.7,41.9 | 37.7,41.9 38.9,41.9 | 38.9,41.9 42.2,41.9 | 42.2,41.9 42.4,41.9 | 42.4,41.9 42.5,42 42.5,42.2 | 42.5,42.2 42.5,43.45 OPTO14.3 | 42.4,41.9 42.8,41.9 | 42.8,41.9 44.2,41.9 | 44.2,41.9 45.7,41.9 | 45.7,41.9 48.7,41.9 | 48.7,41.9 48.85,42.05 | 48.85,42.05 49,42.2 | 49,42.2 49,43.44 OPTO13.3 | 48.7,41.9 49.3,41.9 | 49.3,41.9 50.7,41.9 | 51.8,41.9 52.2,41.9 | 52.2,41.9 55.2,41.9 | 55.2,41.9 55.4,41.9 | 55.4,41.9 55.5,42 55.5,42.2 | 55.5,43.43 55.5,42.2 | 55.5,43.43 OPTO12.3 | 55.4,41.9 55.8,41.9 | 55.8,41.9 57.3,41.9 | 57.3,41.9 58.7,41.9 | 58.7,41.9 61.8,41.9 | 61.8,41.9 62,41.9 | 62,41.9 62.1,42 62.1,42.2 | 62.1,42.2 62.1,43.42 OPTO11.3 | 62,41.9 62.4,41.9 | 62.4,41.9 64,41.9 | 64,41.9 64.2,41.9 | 64.9,41.9 65.3,41.9 | 65.3,41.9 68.3,41.9 | 68.3,41.9 68.5,41.9 | 68.5,41.9 68.6,42 68.6,42.2 | 68.6,42.2 68.6,43.41 OPTO10.3 | 68.5,41.9 68.9,41.9 | 68.9,41.9 70.4,41.9 | 70.4,41.9 71.7,41.9 | 71.7,41.9 74.6,41.9 | 74.6,41.9 74.75,42.05 | 74.75,42.05 74.9,42.2 | 74.9,42.2 74.9,43.4 OPTO9.3 | 74.6,41.9 75.2,41.9 | 75.2,41.9 76.5,41.9 77.4,41 77.4,39.95 OPTO1.3 | OPTO2.3 71.04,41.26 | 70.4,41.9 70.55,41.75 | 70.55,41.75 70.75,41.55 | 70.75,41.55 70.9,41.4 | 70.9,41.4 71.04,41.26 | 64.64,41.26 OPTO3.3 66.19,39.81 v66.5,39.5 | 64,41.9 64.2,41.7 | 64.5,41.4 64.64,41.26 | OPTO4.3 58.04,41.16 | 57.3,41.9 57.45,41.75 | 57.45,41.75 57.65,41.55 | 57.65,41.55 57.8,41.4 | 57.8,41.4 58.04,41.16
  Top 0.2: OPTO5.3 51.44,41.16 | 50.7,41.9 50.95,41.65 | 50.95,41.65 51.15,41.45 | 51.15,41.45 51.35,41.25 | 51.35,41.25 51.44,41.16 | OPTO6.3 44.94,41.16 | 44.2,41.9 44.35,41.75 | 44.35,41.75 44.55,41.55 | 44.55,41.55 44.65,41.45 | 44.65,41.45 44.8,41.3 | 44.8,41.3 44.94,41.16 | OPTO7.3 38.34,41.26 | 38.34,41.26 38.2,41.4 | 38.2,41.4 38,41.6 | 38,41.6 37.85,41.75 | 37.85,41.75 37.7,41.9 | OPTO8.3 31.54,41.26 | 31.54,41.26 31.35,41.45 | 31.35,41.45 31.25,41.55 | 31.25,41.55 31.1,41.7 | 31.1,41.7 30.9,41.9 | v53.5,45.2 54.9,45.2 55.5,44.6 55.5,43.43 | 30,41.9 28.3,41.9 | 28.3,41.9 v23.9,41.9 | 23.7,42.1 23.4,42.4 | 23.4,42.4 Q1.2 | 23.4,42.4 23.4,42.1 | 23.4,42.1 23.4,41.9 | 23.4,41.4 23.4,41.9 | 23.4,41.4 23.4,36.2 22.7,35.5 U49.2 20.52,33.82 18.88,32.18 JP2.2 | 74.9,42.2 75.05,42.05 | 75.05,42.05 75.2,41.9 | 74.75,42.05 75.05,42.05 | 71.04,41.26 71.06,41.26 71.2,41.4 | 71.2,41.4 71.35,41.55 | 71.35,41.55 71.45,41.65 | 71.45,41.65 71.7,41.9 | 70.55,41.75 71.35,41.75 71.45,41.65 | 70.75,41.55 71.35,41.55 | 70.9,41.4 71.2,41.4 | 68.6,42.2 68.3,41.9 | 68.6,42.2 68.9,41.9 | 64.64,41.26 64.66,41.26 64.8,41.4 | 64.8,41.4 64.9,41.5 | 64.9,41.5 65,41.6 | 65,41.6 65.1,41.7 | 65.1,41.7 65.3,41.9 | 64.5,41.4 64.7,41.4 | 64.7,41.4 64.8,41.4 | 64.9,41.9 64.7,41.9 | 64.4,41.9 64.7,41.9 | 64.4,41.9 64.2,41.9 | 64.9,41.9 65.1,41.7 | 64.2,41.9 64.2,41.7 | 64.2,41.7 64.4,41.5 | 64.4,41.7 64.4,41.5 | 64.4,41.5 64.5,41.4 | 64.4,41.9 64.4,41.7 | 64.4,41.7 64.7,41.4 | 64.4,41.9 64.55,41.75 | 64.8,41.5 64.55,41.75 | 64.8,41.5 64.9,41.5 | 64.8,41.8 65,41.6 | 64.7,41.9 64.8,41.8 | 64.8,41.8 64.8,41.5 | 64.7,41.9 64.6,41.8 | 64.55,41.75 64.6,41.8 | 64.6,41.8 64.8,41.8 | 62.1,42.2 61.8,41.9 | 62.1,42.2 62.4,41.9 | 58.04,41.16 58.19,41.31
  Top 0.2: 58.19,41.31 58.43,41.55 | 58.43,41.55 58.54,41.66 | 58.54,41.66 58.7,41.82 58.7,41.9 | 57.45,41.75 58.45,41.75 58.54,41.66 | 57.65,41.55 58.43,41.55 | 57.8,41.4 58.1,41.4 58.19,41.31 | 55.5,42.2 55.2,41.9 | 55.5,42.2 55.8,41.9 | 51.44,41.16 51.46,41.16 51.65,41.35 | 51.65,41.35 51.95,41.65 | 51.95,41.65 52,41.7 | 52,41.7 52.2,41.9 | 50.7,41.9 51,41.9 | 51,41.9 51.2,41.9 | 51.2,41.9 51.4,41.9 | 51.4,41.9 51.8,41.9 | 51.8,41.9 51.85,41.85 | 51.85,41.85 52,41.7 | 50.95,41.65 51.1,41.65 | 51.1,41.65 51.65,41.65 | 51.65,41.65 51.85,41.85 | 51,41.9 51.1,41.8 51.1,41.65 | 51,41.9 51,41.7 50.95,41.65 | 51.2,41.9 51.2,41.5 51.15,41.45 | 51.4,41.35 51.4,41.4 | 51.4,41.9 51.4,41.4 | 51.35,41.25 51.4,41.3 51.4,41.35 | 51.1,41.65 51.4,41.35 | 51.4,41.9 51.65,41.65 | 51.65,41.65 51.65,41.35 | 51.4,41.4 51.65,41.65 | 51.65,41.65 51.95,41.65 | 51.4,41.4 51.45,41.35 51.65,41.35 | 49,42.2 49.15,42.05 | 49.15,42.05 49.3,41.9 | 48.85,42.05 49.15,42.05 | 44.94,41.16 44.96,41.16 45.05,41.25 | 45.05,41.25 45.15,41.35 | 45.15,41.35 45.35,41.55 | 45.35,41.55 45.55,41.75 | 45.55,41.75 45.7,41.9 | 44.35,41.75 45.55,41.75 | 44.55,41.55 45.35,41.55 | 44.65,41.45 45.05,41.45 45.15,41.35 | 44.8,41.3 45,41.3 45.05,41.25 | 42.5,42.2 42.2,41.9 | 42.5,42.2 42.8,41.9 | 38.34,41.26 38.34,41.34 38.4,41.4 | 38.4,41.4 38.55,41.55 | 38.55,41.55 38.75,41.75 | 38.75,41.75 38.9,41.9 | 37.85,41.75 38.75,41.75 | 38,41.6 38.5,41.6 38.55,41.55 | 38.2,41.4 38.4,41.4 | 35.8,42.2 35.95,42.05 | 35.95,42.05 36.1,41.9 | 35.65,42.05 35.95,42.05 | 31.54,41.26 31.69,41.41 | 31.69,41.41 31.73,41.45 | 31.73,41.45 31.98,41.7 | 31.98,41.7 32.18,41.9 | 31.1,41.7 31.7,41.7 | 31.7,41.7 31.98,41.7 | 31.25,41.55 31.55,41.55 31.65,41.45
  Top 0.2: 31.65,41.45 31.69,41.41 | 31.35,41.45 31.65,41.45 | 31.65,41.45 31.73,41.45 | 31.7,41.7 31.7,41.5 31.65,41.45 | 28.75,42.35 28.65,42.25 | 28.65,42.25 28.5,42.1 | 28.5,42.1 28.3,41.9 | 28.5,42.1 29.8,42.1 | 28.75,42.35 29.55,42.35 | 28.65,42.25 29.65,42.25 | v23.9,41.9 23.85,41.85 | 23.85,41.85 23.65,41.65 | 23.65,41.65 23.4,41.4 | 23.4,42.1 23.7,42.1 | 23.7,42.1 v23.9,41.9 | 23.4,41.9 23.8,41.9 23.85,41.85 | 23.4,41.9 23.65,41.65
  Bottom 0.2: R104.1 64.83,39.21 | 64.83,39.21 R105.1 64.83,43.81 R106.1 | IC4.10 53.1,45.59 v53.5,45.2 | TTL-RS1.GND 26.56,60.56 25,59 10.8,59 8.7,56.9 8.7,43.5 10.3,41.9 v23.9,41.9 24,41.9 | v66.5,39.5 66.21,39.21 64.83,39.21
  Bottom 1.016: JP2.8 JP2.6 JP2.4 JP2.2
N$1
  Bottom 0.2: D2.A 79.75,27.09 R1.2
N$2  (via drill 0.35)
  Top 0.2: v69.9,57.5 69.9,55.59 LED10.C 70.04,54.16 71.06,53.14 OPTO10.1
  Bottom 0.2: Z10.C 70.72,58.32 v69.9,57.5
N$3
  Bottom 0.2: D3.A 73.35,26.99 R2.2
N$5
  Bottom 0.2: D4.A 67.05,27.01 R3.2
N$6  (via drill 0.35)
  Top 0.2: v75.8,25.8 75.8,28 LED1.C 74.77,29.03 OPTO1.1
  Bottom 0.2: Z1.C 76.56,25.04 v75.8,25.8
N$7
  Bottom 0.2: D5.A 60.85,27.05 R4.2
N$8  (via drill 0.35)
  Top 0.2: v77.6,25.9 77.57,25.93 LED1.A
  Bottom 0.2: D2.C 78.75,17.76 78.1,18.4 78.1,25.4 v77.6,25.9
N$9
  Bottom 0.2: D6.A 54.55,27.07 R5.2
N$10  (via drill 0.35)
  Top 0.2: v71.2,25.8 71.17,25.83 LED2.A
  Bottom 0.2: D3.C 72.34,17.76 71.7,18.4 71.7,25.3 v71.2,25.8
N$11
  Bottom 0.2: D7.A R6.2
N$12  (via drill 0.35)
  Top 0.2: v69.4,25.8 69.4,28 LED2.C 68.5,28.9 OPTO2.1
  Bottom 0.2: Z2.C 70.26,24.94 v69.4,25.8
N$13
  Bottom 0.2: D8.A 41.91,27.11 R7.2
N$14  (via drill 0.35)
  Top 0.2: v64.9,25.9 64.87,25.93 LED3.A
  Bottom 0.2: D4.C 65.94,17.76 65.4,18.3 65.4,25.4 v64.9,25.9
N$15
  Bottom 0.2: D9.A 35.71,27.13 R8.2
N$16  (via drill 0.35)
  Top 0.2: v63,25.9 63,27.96 LED3.C 62.1,29 OPTO3.1
  Bottom 0.2: Z3.C 63.96,25.04 63.1,25.9 v63,25.9
N$17
  Bottom 0.2: D15.A 48.69,55.69 R14.2
N$18  (via drill 0.35)
  Top 0.2: v58.6,25.8 58.54,25.86 LED4.A
  Bottom 0.2: D5.C 59.45,17.76 59,18.2 59,25.4 v58.6,25.8
N$19  (via drill 0.35)
  Top 0.2: v56.7,25.8 56.7,28.01 LED4.C 55.5,29.29 OPTO4.1
  Bottom 0.2: Z4.C 57.66,24.84 v56.7,25.8
N$20
  Bottom 0.2: D10.A 80.19,55.75 R9.2
N$21  (via drill 0.35)
  Top 0.2: v52.3,25.7 52.3,28.11 LED5.A
  Bottom 0.2: D6.C 53.24,17.76 52.8,18.2 52.8,25.2 v52.3,25.7
N$22  (via drill 0.35)
  Top 0.2: v50.5,25.7 50.5,28.11 LED5.C 48.9,29.79 OPTO5.1
  Bottom 0.2: Z5.C 51.38,24.82 v50.5,25.7
N$23  (via drill 0.35)
  Top 0.2: v46,25.7 45.94,25.76 LED6.A
  Bottom 0.2: D7.C 47.26,17.65 46.5,18.4 46.5,25.2 v46,25.7
N$24
  Bottom 0.2: D11.A 73.89,55.83 R10.2
N$25  (via drill 0.35)
  Top 0.2: v39.6,25.7 39.6,28.21 LED7.A
  Bottom 0.2: D8.C 40.85,17.65 40.1,18.4 40.1,25.3 39.7,25.7 v39.6,25.7
N$26  (via drill 0.35)
  Top 0.2: v44.1,25.7 44.1,28.21 LED6.C 42.4,29.99 OPTO6.1
  Bottom 0.2: Z6.C 45.08,24.72 v44.1,25.7
N$28
  Bottom 0.2: D12.A 67.59,55.81 R11.2
N$36
  Bottom 0.2: D13.A 61.19,55.69 R12.2
N$40
  Bottom 0.2: D14.A 54.99,55.61 R13.2
N$44
  Bottom 0.2: D16.A R15.2
N$48
  Bottom 0.2: D17.A R16.2
N$49  (via drill 0.35)
  Top 0.2: v33.1,25.6 33.1,28.11 LED8.A
  Bottom 0.2: D9.C 34.85,17.65 33.9,18.6 33.9,24.8 v33.1,25.6
N$50  (via drill 0.35)
  Top 0.2: v78.2,57.3 78.2,55.41 LED9.A
  Bottom 0.2: D10.C 78.95,65.16 78.5,64.7 78.5,57.6 v78.2,57.3
N$51  (via drill 0.35)
  Top 0.2: v71.9,57.4 71.84,57.34 LED10.A
  Bottom 0.2: D11.C 72.75,65.16 72.2,64.6 72.2,57.7 v71.9,57.4
N$53  (via drill 0.35)
  Top 0.2: v65.5,57.5 65.54,57.46 LED11.A
  Bottom 0.2: D12.C 66.56,65.16 65.9,64.5 65.9,57.9 v65.5,57.5
N$54  (via drill 0.35)
  Top 0.2: v58.9,57.6 58.9,55.59 LED12.A
  Bottom 0.2: D13.C 60.26,65.05 59.5,64.3 59.5,58.2 v58.9,57.6
N$55  (via drill 0.35)
  Top 0.2: v52.8,57.5 52.8,55.57 LED13.A
  Bottom 0.2: D14.C 53.95,65.05 53.3,64.4 53.3,58 v52.8,57.5
N$57  (via drill 0.35)
  Top 0.2: v46.6,57.5 46.64,57.46 LED14.A
  Bottom 0.2: D15.C 47.55,65.05 47,64.5 47,57.9 v46.6,57.5
N$58  (via drill 0.35)
  Top 0.2: v40.3,57.5 40.34,57.46 LED15.A
  Bottom 0.2: D16.C 41.35,65.05 40.7,64.4 40.7,57.9 v40.3,57.5
N$59  (via drill 0.35)
  Top 0.2: v33.9,57.4 33.94,57.36 LED16.A
  Bottom 0.2: D17.C 35.05,65.05 34.4,64.4 34.4,57.9 v33.9,57.4
N$70  (via drill 0.35)
  Top 0.2: v37.8,25.6 37.8,28.21 LED7.C 35.8,30.29 OPTO7.1
  Bottom 0.2: Z7.C 38.78,24.62 v37.8,25.6
N$72  (via drill 0.35)
  Top 0.2: v31.5,25.4 31.5,28.19 LED8.C 29,30.69 OPTO8.1
  Bottom 0.2: Z8.C 32.58,24.32 v31.5,25.4
N$73  (via drill 0.35)
  Top 0.2: v76.2,57.3 76.2,55.49 LED9.C 76.34,54.26 77.36,53.24 OPTO9.1
  Bottom 0.2: Z9.C 77.02,58.12 v76.2,57.3
N$74  (via drill 0.35)
  Top 0.2: v63.7,57.6 63.7,55.59 LED11.C 63.74,54.16 64.56,53.34 OPTO11.1
  Bottom 0.2: Z11.C 64.42,58.32 v63.7,57.6
N$75  (via drill 0.35)
  Top 0.2: v57.2,57.7 57.2,55.61 LED12.C 57.1,55.51 57.1,54.1 57.96,53.24 OPTO12.1
  Bottom 0.2: Z12.C 58.12,58.62 v57.2,57.7
N$77  (via drill 0.35)
  Top 0.2: v51.1,57.7 51.1,55.59 LED13.C 51.04,52.44 OPTO13.1
  Bottom 0.2: Z13.C 51.92,58.52 v51.1,57.7
N$78  (via drill 0.35)
  Top 0.2: v44.8,57.6 44.84,57.56 LED14.C 44.96,55.41 OPTO14.1
  Bottom 0.2: Z14.C 45.62,58.42 v44.8,57.6
N$79  (via drill 0.35)
  Top 0.2: v38.5,57.6 38.5,55.57 LED15.C 38.26,55.25 OPTO15.1
  Bottom 0.2: Z15.C 39.32,58.42 v38.5,57.6
N$81  (via drill 0.35)
  Top 0.2: v32,57.7 32,55.67 LED16.C 32.14,52.6 OPTO16.1
  Bottom 0.2: Z16.C 33.12,58.82 v32,57.7
N$97
  Top 0.2: U49.1 16.09,35.51 15,36.6 15,46.6 15.97,47.57 D146.-
N$98
  Top 0.2: D146.+ 18.8,50.59 19.94,51.73 R115.1
N$99
  Top 0.2: U49.4 17.98,45.38 20.7,48.1 21.58,48.1 R116.1
N$101  (via drill 0.35)
  Top 0.2: Q1.3 26.5,44.76 v27.3,45.56 27.3,50.1 25,52.4 23.68,52.4 D1.A
  Bottom 0.2: K2.16 11.81,31.81 14.2,34.2 24.9,34.2 27.3,36.6 v27.3,45.56 27.3,45.6
N$102
  Top 0.2: Q1.1 21.01,45.71 20.52,45.22 U49.3
N$109
  Bottom 0.2: IC4.15 55.7,38.87 55.91,38.67 59.67,38.67 60.9,39.9 60.9,41.2 61.8,42.1 61.8,43.5 62.16,43.86 R106.2
N$110
  Bottom 0.2: IC4.16 55,39.42 55,38.6 55.4,38.2 60.4,38.2 61.4,39.2 61.4,40.7 62.26,41.56 R105.2
N$111
  Bottom 0.2: IC4.17 54.4,38.1 54.8,37.7 61,37.7 62.46,39.16 R104.2
NC
  Bottom 0.406: X3.3 32.36,11.2 25.7,11.2 24.51,12.39 K2.O1
NO
  Top 0.406: K2.S1 26.22,10.18 X3.1
OUT1  (via drill 0.35)
  Top 0.2: v72.9,40.2 73.24,39.86 OPTO1.4
  Bottom 0.2: R49.1 58.44,35.76 57.4,36.8 52.6,36.8 51.8,37.59 IC4.21 51.8,40.51 52.1,40.8 59.8,40.8 61.3,42.3 61.3,44.5 62,45.2 65.7,45.2 66.1,44.8 66.1,42.2 68,40.3 72.8,40.3 v72.9,40.2
OUT2  (via drill 0.35)
  Top 0.2: v69.2,38 68.5,38.7 OPTO2.4
  Bottom 0.2: R50.1 55.74,35.66 55.1,36.3 52.1,36.3 51.16,37.25 IC4.22 51.16,40.55 51.9,41.3 59.6,41.3 60.8,42.5 60.8,44.7 61.8,45.7 65.9,45.7 66.6,45 66.6,42.6 68.2,41 73.4,41 73.68,40.72 73.68,38.68 72.9,37.9 69.3,37.9 v69.2,38
OUT3  (via drill 0.35)
  Top 0.2: v66.9,38 62.9,38 62.1,38.8 OPTO3.4
  Bottom 0.2: R51.1 53.14,35.36 52.6,35.9 51.3,35.9 50.5,36.7 IC4.23 50.51,40.91 51.4,41.8 59.4,41.8 60.3,42.7 60.3,44.9 61.6,46.2 66.1,46.2 67.1,45.2 67.1,43.2 68.6,41.7 73.5,41.7 74.3,40.9 74.3,38.3 73.3,37.3 67.6,37.3 v66.9,38
OUT4  (via drill 0.35)
  Top 0.2: v69.9,34.9 56.5,34.9 55.5,35.9 OPTO4.4
  Bottom 0.2: R52.1 50.44,35.96 49.8,36.6 49.8,39.42 IC4.24 49.85,41.16 51,42.3 59,42.3 59.7,43 59.7,45.1 61.3,46.7 66.4,46.7 67.7,45.4 67.7,43.5 68.9,42.3 73.7,42.3 74.9,41.1 74.9,35.8 74,34.9 v69.9,34.9
OUT5  (via drill 0.35)
  Top 0.2: v48.75,35.65 48.9,35.8 OPTO5.4
  Bottom 0.2: R53.1 v48.75,35.65 49.2,36.11 IC4.25
OUT6  (via drill 0.35)
  Top 0.2: v42.4,36.6 OPTO6.4
  Bottom 0.2: R54.1 45.83,35.48 | 45.83,35.48 45.92,35.58 | 45.92,35.58 46.02,35.68 | 46.02,35.68 46.15,35.8 | 46.15,35.8 46.5,35.8 | 46.5,35.8 47.5,35.8 48.55,36.86 IC4.26 | 46.15,35.8 45.8,35.8 | 45.8,35.8 43.2,35.8 v42.4,36.6 | 45.83,35.48 45.83,35.77 45.8,35.8 | 45.92,35.58 46.27,35.58 | 46.27,35.58 46.5,35.8 | 46.02,35.68 46.17,35.68 46.27,35.58
OUT7  (via drill 0.35)
  Top 0.2: v35.8,37.3 OPTO7.4
  Bottom 0.2: R55.1 41.06,37.9 | 41.06,37.9 41.06,36.76 40.6,36.3 36.3,36.3 35.8,36.8 v35.8,37.3 | 41.06,37.9 42.6,37.9 44.1,36.4 47.3,36.4 47.91,37.01 IC4.27
OUT8  (via drill 0.35)
  Top 0.2: OPTO8.4 29,37.2 30.6,35.6 44.9,35.6 46.6,37.3 v46.6,38.1
  Bottom 0.2: R56.1 42.26,40.44 42.6,40.1 42.6,39.7 42.9,39.4 46.4,39.4 | 46.4,39.4 46.8,39.4 | 46.8,39.4 47.26,39.4 IC4.28 | v46.6,38.1 46.6,39.2 | 46.6,39.2 46.8,39.4 | 46.6,39.2 46.4,39.4
OUT9  (via drill 0.35)
  Top 0.2: v77.4,45.9 77.4,43.52 OPTO9.4
  Bottom 0.2: 44.94,42.74 41.36,42.74 R57.1 | IC4.1 46.85,46.79 45.3,45.23 45.3,43.1 | 45.3,43.1 45.3,42.9 | 45.3,42.9 45.3,42.8 | v77.4,45.9 77.4,43.5 76.7,42.8 69.3,42.8 68.2,43.9 68.2,45.7 66.8,47.1 61,47.1 59.2,45.3 59.2,43.3 58.64,42.74 45.7,42.74 | 45.3,42.74 45.7,42.74 | 45.15,42.95 45.3,43.1 | 44.94,42.74 45.15,42.95 | 45.15,42.95 45.25,42.95 45.3,42.9 | 44.94,42.74 45.3,42.74 | 45.15,42.95 45.3,42.8 | 45.3,42.8 45.3,42.74 | 45.3,43.1 45.34,43.1 45.52,42.92 | 45.52,42.92 45.7,42.74 | 45.3,42.9 45.5,42.9 45.52,42.92
OUT10  (via drill 0.35)
  Top 0.2: v71.2,45.6 71.2,43.63 OPTO10.4
  Bottom 0.2: R58.1 45.04,45.64 46.1,46.7 46.1,47.5 46.6,48 47.6,48 47.91,47.7 IC4.2 47.91,45.8 47.6,45.5 46.3,45.5 45.8,45 45.8,43.6 46.2,43.2 58.1,43.2 58.6,43.7 58.6,45.5 60.7,47.6 67.1,47.6 68.9,45.8 68.9,44.2 69.5,43.6 70.7,43.6 71.2,44.1 v71.2,45.6
OUT11  (via drill 0.35)
  Top 0.2: OPTO11.4 64.56,47.14 63,48.7 46.6,48.7 v44.34,46.44
  Bottom 0.2: R59.1 41.66,48.04 43.26,46.44 v44.34,46.44 46.3,48.4 47.9,48.4 48.6,47.7 48.6,46.83 IC4.3
OUT12  (via drill 0.35)
  Top 0.2: OPTO12.4 57.96,47.54 57.4,48.1 46.7,48.1 45.5,46.9 45.5,46 45,45.5 43.6,45.5 43.2,45.9 43.2,47.4 v43.6,47.8
  Bottom 0.2: IC4.4 49.2,47.9 48.2,48.9 45.7,48.9 44.6,47.8 v43.6,47.8 43.1,47.8 42.6,48.3 42.6,49.1 41.24,50.46 R60.1
OUT13  (via drill 0.35)
  Top 0.2: OPTO13.4 51.46,44.44 50.6,45.3 v49.5,45.3
  Bottom 0.2: R61.1 45.48,49.4 48.6,49.4 49.85,48.15 IC4.5 49.85,45.66 v49.5,45.3
OUT14  (via drill 0.35)
  Top 0.2: OPTO14.4 44.96,43.56 45.2,43.8 44.9,44.1 44.9,44.4 v46.9,44.4
  Bottom 0.2: R62.1 48.23,49.9 48.9,49.9 50.51,48.3 IC4.6 50.5,44.6 49.8,43.9 47.4,43.9 v46.9,44.4
OUT15  (via drill 0.35)
  Top 0.2: v36.4,46.4 37.7,46.4 38.3,45.8 38.3,43.48 OPTO15.4
  Bottom 0.2: R63.1 50.44,49.66 51.16,48.95 IC4.7 51.16,44.25 51.7,43.7 57.7,43.7 58.1,44.1 58.1,45.8 60.3,48 67.27,48 68.37,46.9 77.8,46.9 78.5,46.2 78.5,37.8 74.67,33.97 63.97,33.97 60.8,30.8 35.6,30.8 33.9,32.5 33.9,44.6 35.7,46.4 v36.4,46.4
OUT16  (via drill 0.35)
  Top 0.2: v32.8,46.6 32,46.6 31.5,46.1 31.5,43.5 OPTO16.4
  Bottom 0.2: R64.1 53.48,50.73 | 53.48,50.73 53.59,50.84 | 53.48,50.73 53.48,50.27 51.8,48.61 IC4.8 51.8,44.7 52.3,44.2 57.1,44.2 57.5,44.6 57.5,45.9 60,48.4 67.5,48.4 68.5,47.4 78.3,47.4 79,46.7 79,37.3 75.05,33.35 64.02,33.35 60.98,30.3 35.4,30.3 33.37,32.33 33.37,46.03 v32.8,46.6
P1
  Bottom 0.61: R1.1 79.71,7.61 X1.8
P2
  Bottom 0.61: X1.7 73.41,7.97 R2.1
P3
  Bottom 0.61: X1.6 67.11,9.19 R3.1
P4
  Bottom 0.61: X1.5 60.81,10.41 R4.1
P5
  Bottom 0.61: X1.4 58.96,9.74 56.8,11.9 54.54,11.9 R5.1
P6
  Bottom 0.61: X1.3 53.88,8.32 50.3,11.9 R6.1
P7
  Bottom 0.61: X1.2 48.8,8 44.9,11.9 R7.1
P8
  Bottom 0.61: X1.1 43.12,7.18 38.3,12 35.78,12 R8.1
P9
  Bottom 0.61: R9.1 79.18,72 X2.1
P10
  Bottom 0.61: R10.1 73.91,75.93 X2.2
P11
  Bottom 0.61: R11.1 69.02,72.44 X2.3
P12
  Bottom 0.61: R12.1 63.94,73.64 X2.4
P13
  Bottom 0.61: R13.1 57.61,70.81 58.86,72.06 X2.5
P14
  Bottom 0.61: R14.1 51.79,70.89 53.8,72.9 53.8,76.1 X2.6
P15
  Bottom 0.61: R15.1 43.55,70.97 X2.7
P16
  Bottom 0.61: R16.1 38.45,70.95 X2.8
RELAY
  Top 0.2: R115.2 16.87,55.07 16,54.2 16,51.3 13.86,49.16 SV2.1
RESET
  Bottom 0.2: R103.2 62.53,37.26 54.34,37.26 53.76,37.84 IC4.18
RX
  Bottom 0.406: TTL-RS1.RX 23.7,61.59 22.3,60.2 6.2,60.2 5.2,59.2 3.22,59.2 SV2.5
SCL  (via drill 0.35)
  Top 0.2: v13,55.7 13,52.2 11.7,50.9 8.5,50.9 7.7,51.7 SV2.2
  Bottom 0.2: 56.5,50.7 56.4,50.7 R97.1 56.34,50.04 54.41,48.11 IC4.12 | IC4.12 | IC4.12 54.41,45.3 55,44.7 56.5,44.7 56.9,45.1 56.9,46 61.9,51 61.9,53.5 61.2,54.2 29.5,54.2 26.8,56.9 14.2,56.9 v13,55.7
SDA  (via drill 0.35)
  Top 0.2: v10.9,55.3 v6.5,55.3 6.4,55.2
  Bottom 0.2: 59.1,50.69 R98.1 60.39,50.69 60.9,51.2 60.9,53.2 60.4,53.7 12.5,53.7 v10.9,55.3 | 59.1,50.69 58.64,50.69 | IC4.13 55,46.84 55,47.7 55.5,48.2 57,48.2 59.2,50.4 59.2,50.59 59.1,50.69 | v6.5,55.3 5.4,54.2 3.14,54.2 SV2.3
TX
  Bottom 0.406: SV2.6 18.9,61.86 20.7,63.66 TTL-RS1.TX
VCC  (via drill 0.35)
  Top 0.2: D1.C 22.4,56.65 | 22.4,56.65 19.66,56.65 17.72,58.58 TTL-RS1.VCC | 22.4,56.65 21.8,56.05 21.8,50.4 22.1,50.1 22.8,50.1 23.52,49.38 R116.2 23.56,48.1 v25.7,48.1
  Bottom 0.2: R55.2 39.16,40.39 R56.2 | R56.2 39.16,40.49 R57.2 39.16,45.59 R58.2 39.06,45.69 R59.2 | 55.1,52.59 R64.2 50.49,52.59 R63.2 50.39,52.69 R62.2 47.29,52.64 R61.2 44.09,52.69 R60.2 40.09,52.69 39.06,51.66 R59.2 | 55.1,52.59 56.29,52.59 R97.2 56.39,52.59 R98.2 | IC4.9 52.45,47.59 54.7,49.83 54.7,52.19 55.1,52.59 | R103.1 65,36.69 65,35.8 61.63,32.43 R49.2 58.39,32.48 R50.2 55.69,32.53 R51.2 50.49,32.53 R52.2 47.58,32.58 R53.2 44.81,32.56 R54.2 35.69,32.51 34.4,33.8 34.4,39.9 35,40.5 39.05,40.5 R56.2 | K2.1 11.81,11.61 10.8,10.6 5.3,10.6 3.6,12.3 3.6,24.5 JP2.7 | R59.2 25.76,48.04 v25.7,48.1 25.7,36.5 24.8,35.6 5,35.6 3.6,34.2 3.6,31.66 3.66,31.6
  Bottom 1.016: JP2.7 JP2.5 JP2.3 3.66,31.6 JP2.1

### Text on the board
tPlace: 24V | GND | TX | RX | SDA | SCL | RELAY | VCC | GND